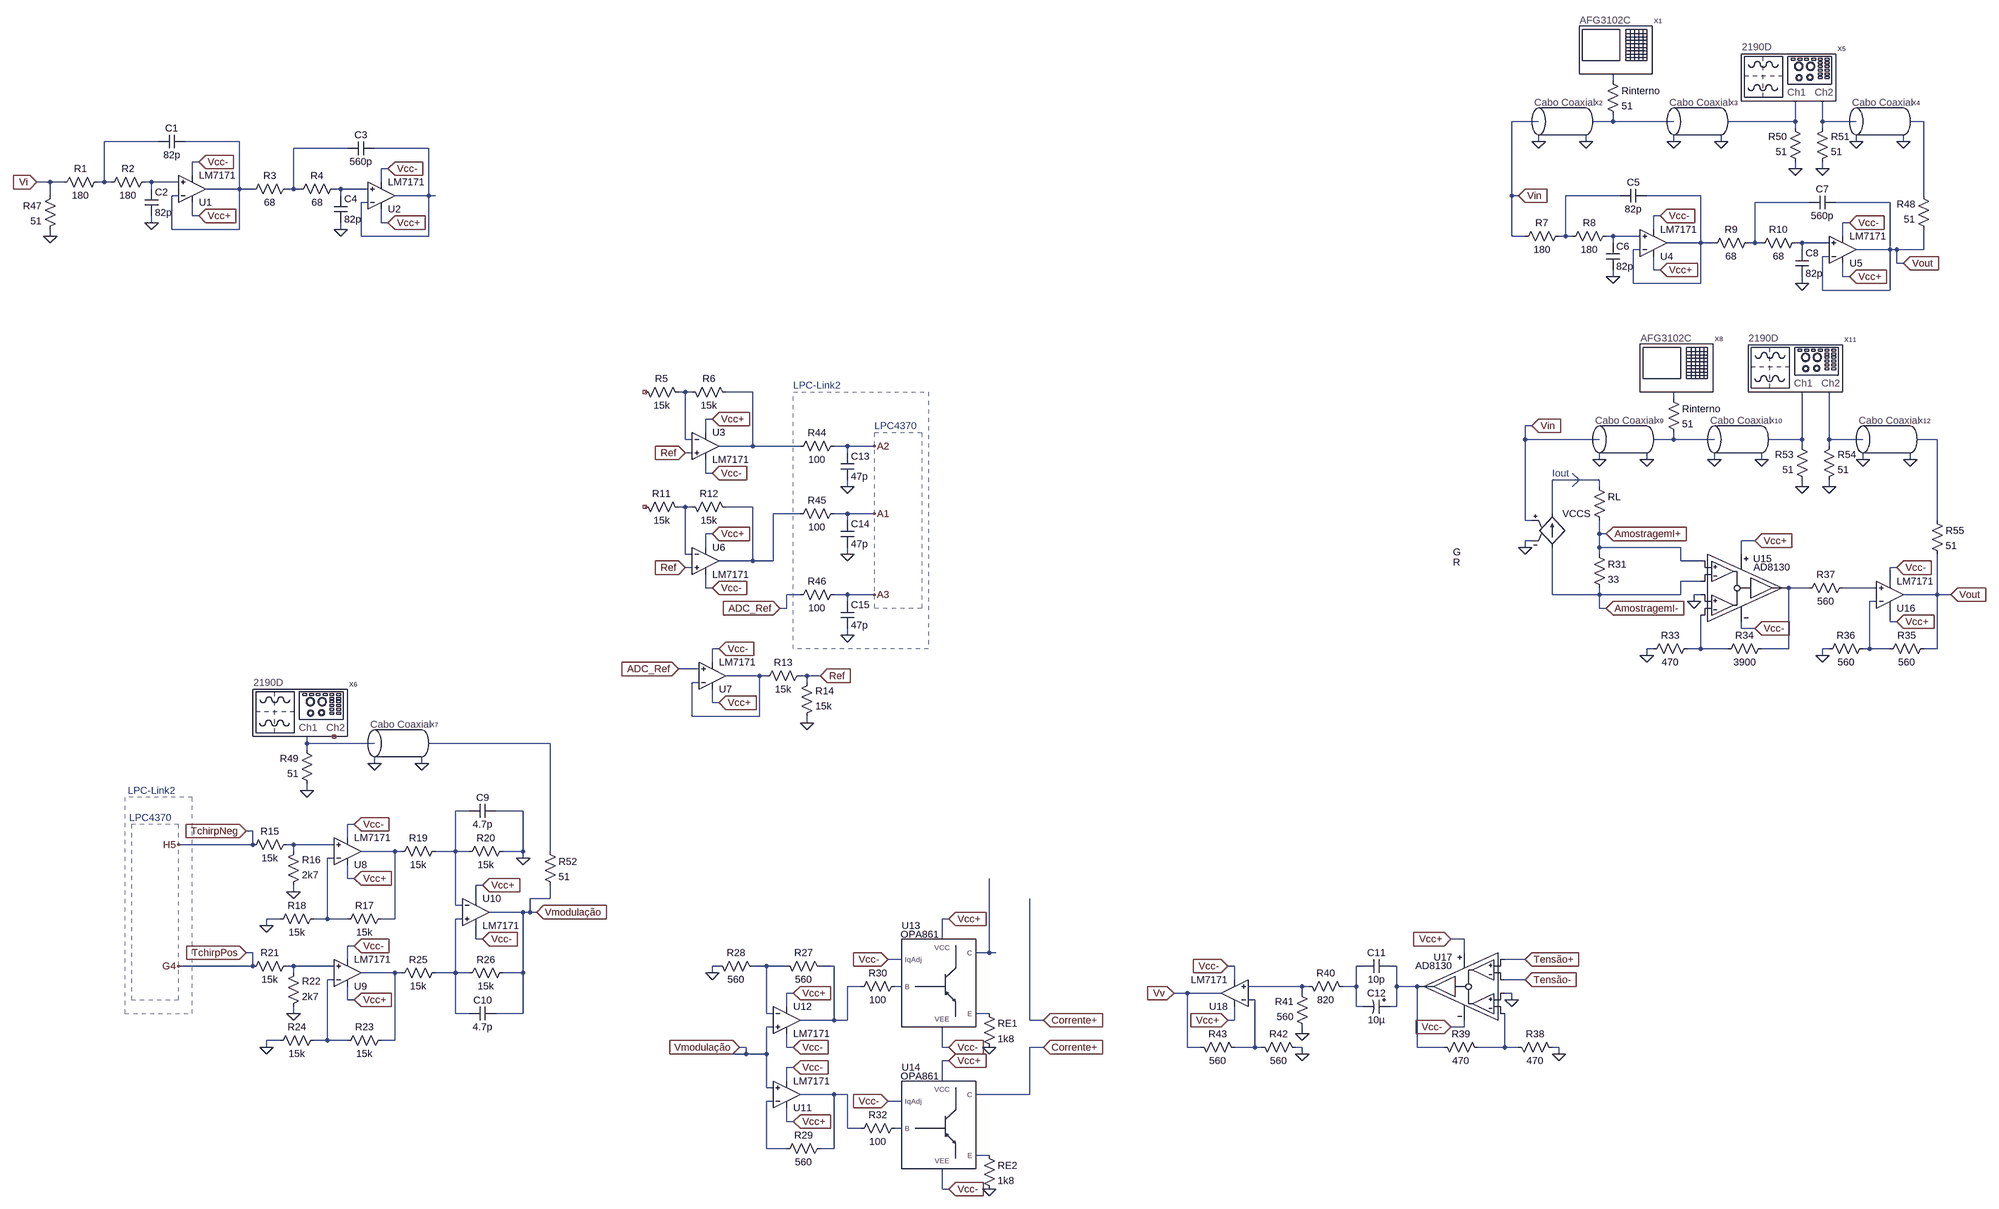
[diagram p0: schematic Circuitos de teste-Modulacao.asc]
Circuitos de teste-Modulacao.asc, the LTspice schematic file:
Version 4
SHEET 1 960 1080
WIRE -1024 -1664 -1024 -1680
WIRE -1200 -1568 -1264 -1568
WIRE -1024 -1568 -1024 -1584
WIRE -1024 -1568 -1072 -1568
WIRE -880 -1568 -1024 -1568
WIRE -592 -1568 -592 -1616
WIRE -592 -1568 -752 -1568
WIRE -528 -1568 -528 -1616
WIRE -448 -1568 -528 -1568
WIRE -288 -1568 -320 -1568
WIRE -592 -1552 -592 -1568
WIRE -528 -1552 -528 -1568
WIRE -4784 -1520 -4912 -1520
WIRE -4592 -1520 -4720 -1520
WIRE -1200 -1520 -1200 -1536
WIRE -1088 -1520 -1088 -1536
WIRE -880 -1520 -880 -1536
WIRE -768 -1520 -768 -1536
WIRE -448 -1520 -448 -1536
WIRE -336 -1520 -336 -1536
WIRE -4336 -1504 -4464 -1504
WIRE -4144 -1504 -4272 -1504
WIRE -4688 -1472 -4704 -1472
WIRE -4240 -1456 -4256 -1456
WIRE -592 -1456 -592 -1472
WIRE -528 -1456 -528 -1472
WIRE -4704 -1440 -4704 -1472
WIRE -5040 -1424 -5072 -1424
WIRE -5008 -1424 -5040 -1424
WIRE -4912 -1424 -4912 -1520
WIRE -4912 -1424 -4928 -1424
WIRE -4896 -1424 -4912 -1424
WIRE -4800 -1424 -4816 -1424
WIRE -4736 -1424 -4800 -1424
WIRE -4256 -1424 -4256 -1456
WIRE -4800 -1408 -4800 -1424
WIRE -4592 -1408 -4592 -1520
WIRE -4592 -1408 -4672 -1408
WIRE -4560 -1408 -4592 -1408
WIRE -4464 -1408 -4464 -1504
WIRE -4464 -1408 -4480 -1408
WIRE -4448 -1408 -4464 -1408
WIRE -4352 -1408 -4368 -1408
WIRE -4288 -1408 -4352 -1408
WIRE -5040 -1392 -5040 -1424
WIRE -4736 -1392 -4752 -1392
WIRE -4352 -1392 -4352 -1408
WIRE -4144 -1392 -4144 -1504
WIRE -4144 -1392 -4224 -1392
WIRE -4128 -1392 -4144 -1392
WIRE -1264 -1392 -1264 -1568
WIRE -1248 -1392 -1264 -1392
WIRE -1008 -1392 -1136 -1392
WIRE -816 -1392 -944 -1392
WIRE -288 -1392 -288 -1568
WIRE -4288 -1376 -4304 -1376
WIRE -560 -1376 -688 -1376
WIRE -368 -1376 -496 -1376
WIRE -4704 -1344 -4704 -1376
WIRE -4688 -1344 -4704 -1344
WIRE -912 -1344 -928 -1344
WIRE -4800 -1328 -4800 -1344
WIRE -4256 -1328 -4256 -1360
WIRE -4240 -1328 -4256 -1328
WIRE -464 -1328 -480 -1328
WIRE -4752 -1312 -4752 -1392
WIRE -4592 -1312 -4592 -1408
WIRE -4592 -1312 -4752 -1312
WIRE -4352 -1312 -4352 -1328
WIRE -928 -1312 -928 -1344
WIRE -5040 -1296 -5040 -1312
WIRE -4304 -1296 -4304 -1376
WIRE -4144 -1296 -4144 -1392
WIRE -4144 -1296 -4304 -1296
WIRE -1264 -1296 -1264 -1392
WIRE -1232 -1296 -1264 -1296
WIRE -1136 -1296 -1136 -1392
WIRE -1136 -1296 -1152 -1296
WIRE -1120 -1296 -1136 -1296
WIRE -1024 -1296 -1040 -1296
WIRE -960 -1296 -1024 -1296
WIRE -480 -1296 -480 -1328
WIRE -1024 -1280 -1024 -1296
WIRE -816 -1280 -816 -1392
WIRE -816 -1280 -896 -1280
WIRE -784 -1280 -816 -1280
WIRE -688 -1280 -688 -1376
WIRE -688 -1280 -704 -1280
WIRE -672 -1280 -688 -1280
WIRE -576 -1280 -592 -1280
WIRE -512 -1280 -576 -1280
WIRE -960 -1264 -976 -1264
WIRE -576 -1264 -576 -1280
WIRE -368 -1264 -368 -1376
WIRE -368 -1264 -448 -1264
WIRE -352 -1264 -368 -1264
WIRE -288 -1264 -288 -1312
WIRE -288 -1264 -352 -1264
WIRE -512 -1248 -528 -1248
WIRE -352 -1232 -352 -1264
WIRE -336 -1232 -352 -1232
WIRE -928 -1216 -928 -1248
WIRE -912 -1216 -928 -1216
WIRE -1024 -1200 -1024 -1216
WIRE -480 -1200 -480 -1232
WIRE -464 -1200 -480 -1200
WIRE -976 -1184 -976 -1264
WIRE -816 -1184 -816 -1280
WIRE -816 -1184 -976 -1184
WIRE -576 -1184 -576 -1200
WIRE -528 -1168 -528 -1248
WIRE -368 -1168 -368 -1264
WIRE -368 -1168 -528 -1168
WIRE -3536 -880 -3552 -880
WIRE -3520 -880 -3536 -880
WIRE -3376 -880 -3440 -880
WIRE -880 -864 -880 -880
WIRE -3472 -816 -3488 -816
WIRE -1216 -800 -1232 -800
WIRE -3488 -784 -3488 -816
WIRE -3536 -768 -3536 -880
WIRE -3520 -768 -3536 -768
WIRE -1232 -768 -1232 -800
WIRE -1056 -768 -1232 -768
WIRE -880 -768 -880 -784
WIRE -880 -768 -928 -768
WIRE -784 -768 -880 -768
WIRE -576 -768 -576 -880
WIRE -576 -768 -656 -768
WIRE -512 -768 -512 -880
WIRE -432 -768 -512 -768
WIRE -256 -768 -304 -768
WIRE -3376 -752 -3376 -880
WIRE -3376 -752 -3456 -752
WIRE -3264 -752 -3376 -752
WIRE -3152 -752 -3184 -752
WIRE -3088 -752 -3152 -752
WIRE -576 -752 -576 -768
WIRE -512 -752 -512 -768
WIRE -3520 -736 -3536 -736
WIRE -3152 -736 -3152 -752
WIRE -1056 -720 -1056 -736
WIRE -944 -720 -944 -736
WIRE -784 -720 -784 -736
WIRE -672 -720 -672 -736
WIRE -432 -720 -432 -736
WIRE -320 -720 -320 -736
WIRE -3488 -688 -3488 -720
WIRE -3472 -688 -3488 -688
WIRE -1056 -672 -1168 -672
WIRE -3152 -656 -3152 -672
WIRE -1056 -656 -1056 -672
WIRE -576 -656 -576 -672
WIRE -512 -656 -512 -672
WIRE -3536 -608 -3552 -608
WIRE -3520 -608 -3536 -608
WIRE -3376 -608 -3440 -608
WIRE -3264 -592 -3328 -592
WIRE -3152 -592 -3184 -592
WIRE -3088 -592 -3152 -592
WIRE -1168 -592 -1168 -672
WIRE -3152 -576 -3152 -592
WIRE -1232 -576 -1232 -768
WIRE -1216 -576 -1232 -576
WIRE -256 -576 -256 -768
WIRE -3472 -544 -3488 -544
WIRE -1056 -544 -1056 -576
WIRE -1040 -544 -1056 -544
WIRE -1216 -528 -1232 -528
WIRE -688 -528 -720 -528
WIRE -3488 -512 -3488 -544
WIRE -1232 -512 -1232 -528
WIRE -1056 -512 -1056 -544
WIRE -864 -512 -1056 -512
WIRE -3536 -496 -3536 -608
WIRE -3520 -496 -3536 -496
WIRE -3152 -496 -3152 -512
WIRE -1056 -496 -1056 -512
WIRE -720 -496 -720 -528
WIRE -3376 -480 -3376 -608
WIRE -3376 -480 -3456 -480
WIRE -3328 -480 -3328 -592
WIRE -3328 -480 -3376 -480
WIRE -864 -480 -864 -512
WIRE -816 -480 -864 -480
WIRE -3520 -464 -3536 -464
WIRE -352 -464 -368 -464
WIRE -816 -432 -864 -432
WIRE -368 -432 -368 -464
WIRE -3488 -416 -3488 -448
WIRE -3472 -416 -3488 -416
WIRE -560 -416 -608 -416
WIRE -400 -416 -480 -416
WIRE -3264 -400 -3296 -400
WIRE -3152 -400 -3184 -400
WIRE -3088 -400 -3152 -400
WIRE -1168 -400 -1168 -512
WIRE -1056 -400 -1056 -416
WIRE -1056 -400 -1168 -400
WIRE -864 -400 -864 -432
WIRE -864 -400 -1056 -400
WIRE -816 -400 -832 -400
WIRE -256 -400 -256 -496
WIRE -256 -400 -336 -400
WIRE -224 -400 -256 -400
WIRE -3152 -384 -3152 -400
WIRE -832 -384 -832 -400
WIRE -400 -384 -416 -384
WIRE -3296 -368 -3296 -400
WIRE -3296 -368 -3312 -368
WIRE -1056 -368 -1056 -400
WIRE -1040 -368 -1056 -368
WIRE -368 -336 -368 -368
WIRE -352 -336 -368 -336
WIRE -720 -320 -720 -336
WIRE -688 -320 -720 -320
WIRE -3152 -304 -3152 -320
WIRE -3456 -272 -3472 -272
WIRE -928 -272 -944 -272
WIRE -816 -272 -816 -352
WIRE -816 -272 -848 -272
WIRE -752 -272 -816 -272
WIRE -608 -272 -608 -416
WIRE -608 -272 -672 -272
WIRE -512 -272 -528 -272
WIRE -416 -272 -416 -384
WIRE -416 -272 -432 -272
WIRE -368 -272 -416 -272
WIRE -256 -272 -256 -400
WIRE -256 -272 -288 -272
WIRE -944 -256 -944 -272
WIRE -528 -256 -528 -272
WIRE -3472 -240 -3472 -272
WIRE -3504 -224 -3552 -224
WIRE -3360 -208 -3440 -208
WIRE -3344 -208 -3360 -208
WIRE -3248 -208 -3264 -208
WIRE -3216 -208 -3248 -208
WIRE -3504 -192 -3520 -192
WIRE -3248 -192 -3248 -208
WIRE -3472 -144 -3472 -176
WIRE -3456 -144 -3472 -144
WIRE -3520 -112 -3520 -192
WIRE -3360 -112 -3360 -208
WIRE -3360 -112 -3520 -112
WIRE -3248 -96 -3248 -112
WIRE -4432 -48 -4432 -64
WIRE -4272 -48 -4432 -48
WIRE -3856 -48 -4144 -48
WIRE -4432 -32 -4432 -48
WIRE -4272 0 -4272 -16
WIRE -4160 0 -4160 -16
WIRE -4432 64 -4432 48
WIRE -4048 112 -4080 112
WIRE -3920 112 -3984 112
WIRE -4320 144 -4336 144
WIRE -4560 160 -4576 160
WIRE -4336 176 -4336 144
WIRE -4560 192 -4560 160
WIRE -4560 192 -4736 192
WIRE -4464 192 -4480 192
WIRE -4368 192 -4464 192
WIRE -4464 208 -4464 192
WIRE -4224 208 -4304 208
WIRE -4208 208 -4224 208
WIRE -4080 208 -4080 112
WIRE -4080 208 -4128 208
WIRE -4048 208 -4080 208
WIRE -3920 208 -3920 112
WIRE -3920 208 -3968 208
WIRE -3856 208 -3856 -48
WIRE -4368 224 -4384 224
WIRE -3920 224 -3920 208
WIRE -4336 272 -4336 240
WIRE -4320 272 -4336 272
WIRE -4016 288 -4032 288
WIRE -4464 304 -4464 288
WIRE -4032 320 -4032 288
WIRE -3856 320 -3856 288
WIRE -3856 320 -3904 320
WIRE -4080 336 -4080 208
WIRE -4064 336 -4080 336
WIRE -3920 352 -4000 352
WIRE -3904 352 -3904 320
WIRE -3904 352 -3920 352
WIRE -3888 352 -3904 352
WIRE -4496 368 -4528 368
WIRE -4384 368 -4384 224
WIRE -4384 368 -4416 368
WIRE -4336 368 -4384 368
WIRE -4224 368 -4224 208
WIRE -4224 368 -4256 368
WIRE -4064 368 -4080 368
WIRE -2912 368 -2928 368
WIRE -4528 384 -4528 368
WIRE -4032 416 -4032 384
WIRE -4016 416 -4032 416
WIRE -2928 416 -2928 368
WIRE -1376 416 -1408 416
WIRE -4320 432 -4336 432
WIRE -4560 448 -4576 448
WIRE -2816 448 -2816 272
WIRE -2816 448 -2848 448
WIRE -2800 448 -2816 448
WIRE -1376 448 -1376 416
WIRE -4336 464 -4336 432
WIRE -3024 464 -3056 464
WIRE -1232 464 -1280 464
WIRE -4560 480 -4560 448
WIRE -4560 480 -4736 480
WIRE -4464 480 -4480 480
WIRE -4368 480 -4464 480
WIRE -3456 480 -3472 480
WIRE -3344 480 -3376 480
WIRE -3296 480 -3344 480
WIRE -3184 480 -3216 480
WIRE -1920 480 -1936 480
WIRE -1616 480 -1632 480
WIRE -1536 480 -1552 480
WIRE -4464 496 -4464 480
WIRE -4224 496 -4304 496
WIRE -4208 496 -4224 496
WIRE -4080 496 -4080 368
WIRE -4080 496 -4128 496
WIRE -4048 496 -4080 496
WIRE -3920 496 -3920 352
WIRE -3920 496 -3968 496
WIRE -3472 496 -3472 480
WIRE -4368 512 -4384 512
WIRE -1920 512 -1920 480
WIRE -1232 512 -1280 512
WIRE -3120 528 -3152 528
WIRE -3024 528 -3040 528
WIRE -1760 528 -1888 528
WIRE -1744 528 -1760 528
WIRE -1632 528 -1632 480
WIRE -1632 528 -1664 528
WIRE -1536 528 -1536 480
WIRE -1488 528 -1536 528
WIRE -3280 544 -3296 544
WIRE -2032 544 -2064 544
WIRE -1952 544 -2032 544
WIRE -1760 544 -1760 528
WIRE -1264 544 -1280 544
WIRE -4336 560 -4336 528
WIRE -4320 560 -4336 560
WIRE -1872 560 -1888 560
WIRE -1264 560 -1264 544
WIRE -3296 576 -3296 544
WIRE -1632 576 -1632 528
WIRE -1616 576 -1632 576
WIRE -1536 576 -1536 528
WIRE -1536 576 -1552 576
WIRE -4464 592 -4464 576
WIRE -4080 592 -4080 496
WIRE -4048 592 -4080 592
WIRE -3920 592 -3920 496
WIRE -3920 592 -3984 592
WIRE -3344 592 -3344 480
WIRE -3328 592 -3344 592
WIRE -2816 592 -2848 592
WIRE -3184 608 -3184 480
WIRE -3184 608 -3264 608
WIRE -3152 608 -3152 528
WIRE -3152 608 -3184 608
WIRE -2720 608 -2720 320
WIRE -2688 608 -2720 608
WIRE -1920 608 -1920 576
WIRE -1920 608 -1936 608
WIRE -3328 624 -3344 624
WIRE -1376 624 -1376 608
WIRE -1376 624 -1408 624
WIRE -1760 640 -1760 624
WIRE -4496 656 -4528 656
WIRE -4384 656 -4384 512
WIRE -4384 656 -4416 656
WIRE -4336 656 -4384 656
WIRE -4224 656 -4224 496
WIRE -4224 656 -4256 656
WIRE -4528 672 -4528 656
WIRE -3392 672 -3408 672
WIRE -3296 672 -3296 640
WIRE -3280 672 -3296 672
WIRE -2928 672 -2928 624
WIRE -2912 672 -2928 672
WIRE -2688 672 -2720 672
WIRE -2032 672 -2032 544
WIRE -2000 672 -2032 672
WIRE -1872 672 -1872 560
WIRE -1872 672 -1920 672
WIRE -1856 672 -1872 672
WIRE -1760 672 -1776 672
WIRE -1488 672 -1488 528
WIRE -1424 672 -1488 672
WIRE -1280 672 -1280 592
WIRE -1280 672 -1344 672
WIRE -1248 672 -1280 672
WIRE -1152 672 -1168 672
WIRE -3392 688 -3392 672
WIRE -3392 688 -3552 688
WIRE -3344 688 -3344 624
WIRE -3344 688 -3392 688
WIRE -1760 688 -1760 672
WIRE -1152 688 -1152 672
WIRE -2912 704 -2928 704
WIRE -3280 720 -3296 720
WIRE -3296 752 -3296 720
WIRE -2928 752 -2928 704
WIRE -3344 768 -3344 688
WIRE -3328 768 -3344 768
WIRE -3184 784 -3264 784
WIRE -3152 784 -3184 784
WIRE -2720 784 -2720 672
WIRE -2720 784 -2848 784
WIRE -3328 800 -3344 800
WIRE -3024 800 -3056 800
WIRE -3296 848 -3296 816
WIRE -3280 848 -3296 848
WIRE -3152 864 -3152 784
WIRE -3120 864 -3152 864
WIRE -3024 864 -3040 864
WIRE -3344 912 -3344 800
WIRE -3296 912 -3344 912
WIRE -3184 912 -3184 784
WIRE -3184 912 -3216 912
WIRE -2816 928 -2848 928
WIRE -2928 1008 -2928 960
WIRE -2912 1008 -2928 1008
FLAG -4800 -1328 0
FLAG -4688 -1344 Vcc+
IOPIN -4688 -1344 In
FLAG -4688 -1472 Vcc-
IOPIN -4688 -1472 In
FLAG -4352 -1312 0
FLAG -4240 -1328 Vcc+
IOPIN -4240 -1328 In
FLAG -4240 -1456 Vcc-
IOPIN -4240 -1456 In
FLAG -3472 -816 Vcc+
IOPIN -3472 -816 In
FLAG -3472 -688 Vcc-
IOPIN -3472 -688 In
FLAG -1024 -1200 0
FLAG -912 -1216 Vcc+
IOPIN -912 -1216 In
FLAG -912 -1344 Vcc-
IOPIN -912 -1344 In
FLAG -576 -1184 0
FLAG -464 -1200 Vcc+
IOPIN -464 -1200 In
FLAG -464 -1328 Vcc-
IOPIN -464 -1328 In
FLAG -3472 -544 Vcc+
IOPIN -3472 -544 In
FLAG -3472 -416 Vcc-
IOPIN -3472 -416 In
FLAG -3456 -144 Vcc+
IOPIN -3456 -144 In
FLAG -3456 -272 Vcc-
IOPIN -3456 -272 In
FLAG -3248 -96 0
FLAG -3552 -224 ADC_Ref
IOPIN -3552 -224 In
FLAG -3216 -208 Ref
IOPIN -3216 -208 In
FLAG -3536 -464 Ref
IOPIN -3536 -464 In
FLAG -3536 -736 Ref
IOPIN -3536 -736 In
FLAG -4320 272 Vcc+
IOPIN -4320 272 In
FLAG -4320 144 Vcc-
IOPIN -4320 144 In
FLAG -4464 304 0
FLAG -4320 560 Vcc+
IOPIN -4320 560 In
FLAG -4320 432 Vcc-
IOPIN -4320 432 In
FLAG -4464 592 0
FLAG -4016 288 Vcc+
IOPIN -4016 288 In
FLAG -4016 416 Vcc-
IOPIN -4016 416 In
FLAG -3920 224 0
FLAG -4576 160 TchirpNeg
IOPIN -4576 160 In
FLAG -4576 448 TchirpPos
IOPIN -4576 448 In
FLAG -4528 672 0
FLAG -4528 384 0
FLAG -3280 848 Vcc+
IOPIN -3280 848 In
FLAG -3280 720 Vcc-
IOPIN -3280 720 In
FLAG -3280 544 Vcc+
IOPIN -3280 544 In
FLAG -3280 672 Vcc-
IOPIN -3280 672 In
FLAG -3472 496 0
FLAG -2912 672 Vcc-
IOPIN -2912 672 In
FLAG -2912 368 Vcc+
IOPIN -2912 368 In
FLAG -2816 672 0
FLAG -2912 1008 Vcc-
IOPIN -2912 1008 In
FLAG -2912 704 Vcc+
IOPIN -2912 704 In
FLAG -2816 1008 0
FLAG -3056 464 Vcc-
IOPIN -3056 464 In
FLAG -3056 800 Vcc-
IOPIN -3056 800 In
FLAG -832 -384 0
FLAG -944 -256 0
FLAG -352 -336 Vcc+
IOPIN -352 -336 In
FLAG -352 -464 Vcc-
IOPIN -352 -464 In
FLAG -528 -256 0
FLAG -688 -320 Vcc-
IOPIN -688 -320 In
FLAG -688 -528 Vcc+
IOPIN -688 -528 In
FLAG -1040 -368 AmostragemI-
IOPIN -1040 -368 In
FLAG -1040 -544 AmostragemI+
IOPIN -1040 -544 In
FLAG -1264 560 0
FLAG -1152 688 0
FLAG -1936 608 Vcc+
IOPIN -1936 608 In
FLAG -1936 480 Vcc-
IOPIN -1936 480 In
FLAG -1760 688 0
FLAG -1408 624 Vcc-
IOPIN -1408 624 In
FLAG -1408 416 Vcc+
IOPIN -1408 416 In
FLAG -1232 512 Tensão-
IOPIN -1232 512 In
FLAG -1232 464 Tensão+
IOPIN -1232 464 In
FLAG -1760 640 0
FLAG -224 -400 Vout
IOPIN -224 -400 In
FLAG -2064 544 Vv
IOPIN -2064 544 In
FLAG -2688 672 Corrente+
IOPIN -2688 672 In
FLAG -2688 608 Corrente+
IOPIN -2688 608 In
FLAG -3152 -656 0
FLAG -3152 -496 0
FLAG -5072 -1424 Vi
IOPIN -5072 -1424 In
FLAG -1248 -1392 Vin
IOPIN -1248 -1392 In
FLAG -3152 -304 0
FLAG -3312 -368 ADC_Ref
IOPIN -3312 -368 In
FLAG -3088 -752 A2
FLAG -3088 -592 A1
FLAG -3088 -400 A3
FLAG -3408 672 Vmodulação
IOPIN -3408 672 In
FLAG -3888 352 Vmodulação
IOPIN -3888 352 In
FLAG -4736 192 H5
FLAG -4736 480 G4
FLAG -5040 -1296 0
FLAG -1200 -1520 0
FLAG -1088 -1520 0
FLAG -880 -1520 0
FLAG -768 -1520 0
FLAG -592 -1456 0
FLAG -528 -1456 0
FLAG -448 -1520 0
FLAG -336 -1520 0
FLAG -336 -1232 Vout
IOPIN -336 -1232 In
FLAG -4432 64 0
FLAG -4272 0 0
FLAG -4160 0 0
FLAG -1056 -720 0
FLAG -944 -720 0
FLAG -784 -720 0
FLAG -672 -720 0
FLAG -576 -656 0
FLAG -512 -656 0
FLAG -432 -720 0
FLAG -320 -720 0
FLAG -1232 -512 0
FLAG -1216 -800 Vin
IOPIN -1216 -800 In
SYMBOL Opamps\\opamp2 -4704 -1344 M180
SYMATTR InstName U1
SYMATTR Value LM7171
SYMBOL res -4912 -1440 R90
WINDOW 0 0 56 VBottom 2
WINDOW 3 32 56 VTop 2
SYMATTR InstName R1
SYMATTR Value 180
SYMBOL res -4800 -1440 R90
WINDOW 0 0 56 VBottom 2
WINDOW 3 32 56 VTop 2
SYMATTR InstName R2
SYMATTR Value 180
SYMBOL cap -4720 -1536 R90
WINDOW 0 0 32 VBottom 2
WINDOW 3 32 32 VTop 2
SYMATTR InstName C1
SYMATTR Value 82p
SYMBOL cap -4816 -1408 R0
SYMATTR InstName C2
SYMATTR Value 82p
SYMBOL Opamps\\opamp2 -4256 -1328 M180
SYMATTR InstName U2
SYMATTR Value LM7171
SYMBOL res -4464 -1424 R90
WINDOW 0 0 56 VBottom 2
WINDOW 3 32 56 VTop 2
SYMATTR InstName R3
SYMATTR Value 68
SYMBOL res -4352 -1424 R90
WINDOW 0 0 56 VBottom 2
WINDOW 3 32 56 VTop 2
SYMATTR InstName R4
SYMATTR Value 68
SYMBOL cap -4272 -1520 R90
WINDOW 0 0 32 VBottom 2
WINDOW 3 32 32 VTop 2
SYMATTR InstName C3
SYMATTR Value 560p
SYMBOL cap -4368 -1392 R0
SYMATTR InstName C4
SYMATTR Value 82p
SYMBOL Opamps\\opamp2 -3488 -816 R0
SYMATTR InstName U3
SYMATTR Value LM7171
SYMBOL res -3536 -864 M270
WINDOW 0 32 56 VTop 2
WINDOW 3 0 56 VBottom 2
SYMATTR InstName R5
SYMATTR Value 15k
SYMBOL res -3424 -864 M270
WINDOW 0 32 56 VTop 2
WINDOW 3 0 56 VBottom 2
SYMATTR InstName R6
SYMATTR Value 15k
SYMBOL Opamps\\opamp2 -928 -1216 M180
SYMATTR InstName U4
SYMATTR Value LM7171
SYMBOL res -1136 -1312 R90
WINDOW 0 0 56 VBottom 2
WINDOW 3 32 56 VTop 2
SYMATTR InstName R7
SYMATTR Value 180
SYMBOL res -1024 -1312 R90
WINDOW 0 0 56 VBottom 2
WINDOW 3 32 56 VTop 2
SYMATTR InstName R8
SYMATTR Value 180
SYMBOL cap -944 -1408 R90
WINDOW 0 0 32 VBottom 2
WINDOW 3 32 32 VTop 2
SYMATTR InstName C5
SYMATTR Value 82p
SYMBOL cap -1040 -1280 R0
SYMATTR InstName C6
SYMATTR Value 82p
SYMBOL Opamps\\opamp2 -480 -1200 M180
SYMATTR InstName U5
SYMATTR Value LM7171
SYMBOL res -688 -1296 R90
WINDOW 0 0 56 VBottom 2
WINDOW 3 32 56 VTop 2
SYMATTR InstName R9
SYMATTR Value 68
SYMBOL res -576 -1296 R90
WINDOW 0 0 56 VBottom 2
WINDOW 3 32 56 VTop 2
SYMATTR InstName R10
SYMATTR Value 68
SYMBOL cap -496 -1392 R90
WINDOW 0 0 32 VBottom 2
WINDOW 3 32 32 VTop 2
SYMATTR InstName C7
SYMATTR Value 560p
SYMBOL cap -592 -1264 R0
SYMATTR InstName C8
SYMATTR Value 82p
SYMBOL Opamps\\opamp2 -3488 -544 R0
SYMATTR InstName U6
SYMATTR Value LM7171
SYMBOL res -3536 -592 M270
WINDOW 0 32 56 VTop 2
WINDOW 3 0 56 VBottom 2
SYMATTR InstName R11
SYMATTR Value 15k
SYMBOL res -3424 -592 M270
WINDOW 0 32 56 VTop 2
WINDOW 3 0 56 VBottom 2
SYMATTR InstName R12
SYMATTR Value 15k
SYMBOL Opamps\\opamp2 -3472 -144 M180
SYMATTR InstName U7
SYMATTR Value LM7171
SYMBOL res -3248 -224 R90
WINDOW 0 0 56 VBottom 2
WINDOW 3 32 56 VTop 2
SYMATTR InstName R13
SYMATTR Value 15k
SYMBOL res -3264 -96 M180
WINDOW 0 36 76 Left 2
WINDOW 3 36 40 Left 2
SYMATTR InstName R14
SYMATTR Value 15k
SYMBOL Opamps\\opamp2 -4336 272 M180
SYMATTR InstName U8
SYMATTR Value LM7171
SYMBOL res -4464 176 R90
WINDOW 0 0 56 VBottom 2
WINDOW 3 32 56 VTop 2
SYMATTR InstName R15
SYMATTR Value 15k
SYMBOL res -4480 304 M180
WINDOW 0 36 76 Left 2
WINDOW 3 36 40 Left 2
SYMATTR InstName R16
SYMATTR Value 2k7
SYMBOL res -4240 352 R90
WINDOW 0 0 56 VBottom 2
WINDOW 3 32 56 VTop 2
SYMATTR InstName R17
SYMATTR Value 15k
SYMBOL res -4512 384 R270
WINDOW 0 32 56 VTop 2
WINDOW 3 0 56 VBottom 2
SYMATTR InstName R18
SYMATTR Value 15k
SYMBOL res -4112 192 R90
WINDOW 0 0 56 VBottom 2
WINDOW 3 32 56 VTop 2
SYMATTR InstName R19
SYMATTR Value 15k
SYMBOL res -3952 192 R90
WINDOW 0 0 56 VBottom 2
WINDOW 3 32 56 VTop 2
SYMATTR InstName R20
SYMATTR Value 15k
SYMBOL cap -3984 96 R90
WINDOW 0 0 32 VBottom 2
WINDOW 3 32 32 VTop 2
SYMATTR InstName C9
SYMATTR Value 4.7p
SYMBOL Opamps\\opamp2 -4336 560 M180
SYMATTR InstName U9
SYMATTR Value LM7171
SYMBOL res -4464 464 R90
WINDOW 0 0 56 VBottom 2
WINDOW 3 32 56 VTop 2
SYMATTR InstName R21
SYMATTR Value 15k
SYMBOL res -4480 592 M180
WINDOW 0 36 76 Left 2
WINDOW 3 36 40 Left 2
SYMATTR InstName R22
SYMATTR Value 2k7
SYMBOL res -4240 640 R90
WINDOW 0 0 56 VBottom 2
WINDOW 3 32 56 VTop 2
SYMATTR InstName R23
SYMATTR Value 15k
SYMBOL res -4512 672 R270
WINDOW 0 32 56 VTop 2
WINDOW 3 0 56 VBottom 2
SYMATTR InstName R24
SYMATTR Value 15k
SYMBOL Opamps\\opamp2 -4032 288 R0
SYMATTR InstName U10
SYMATTR Value LM7171
SYMBOL res -4112 480 R90
WINDOW 0 0 56 VBottom 2
WINDOW 3 32 56 VTop 2
SYMATTR InstName R25
SYMATTR Value 15k
SYMBOL res -3952 480 R90
WINDOW 0 0 56 VBottom 2
WINDOW 3 32 56 VTop 2
SYMATTR InstName R26
SYMATTR Value 15k
SYMBOL cap -3984 576 R90
WINDOW 0 0 32 VBottom 2
WINDOW 3 32 32 VTop 2
SYMATTR InstName C10
SYMATTR Value 4.7p
SYMBOL Opamps\\opamp2 -3296 848 M180
SYMATTR InstName U11
SYMATTR Value LM7171
SYMBOL res -3200 896 R90
WINDOW 0 0 56 VBottom 2
WINDOW 3 32 56 VTop 2
SYMATTR InstName R29
SYMATTR Value 560
SYMBOL Opamps\\opamp2 -3296 544 R0
SYMATTR InstName U12
SYMATTR Value LM7171
SYMBOL res -3200 496 M270
WINDOW 0 32 56 VTop 2
WINDOW 3 0 56 VBottom 2
SYMATTR InstName R27
SYMATTR Value 560
SYMBOL res -3360 496 M270
WINDOW 0 32 56 VTop 2
WINDOW 3 0 56 VBottom 2
SYMATTR InstName R28
SYMATTR Value 560
SYMBOL opa681 -2960 560 R0
SYMATTR InstName U13
SYMBOL res -2832 576 R0
SYMATTR InstName RE1
SYMATTR Value 1k8
SYMBOL res -3024 512 R90
WINDOW 0 0 56 VBottom 2
WINDOW 3 32 56 VTop 2
SYMATTR InstName R30
SYMATTR Value 100
SYMBOL opa681 -2960 896 R0
SYMATTR InstName U14
SYMBOL res -2832 912 R0
SYMATTR InstName RE2
SYMATTR Value 1k8
SYMBOL res -3024 848 R90
WINDOW 0 0 56 VBottom 2
WINDOW 3 32 56 VTop 2
SYMATTR InstName R32
SYMATTR Value 100
SYMBOL res -1072 -512 R0
SYMATTR InstName R31
SYMATTR Value 33
SYMBOL ad8130 -736 -416 R0
SYMATTR InstName U15
SYMBOL res -832 -288 R90
WINDOW 0 0 56 VBottom 2
WINDOW 3 32 56 VTop 2
SYMATTR InstName R33
SYMATTR Value 470
SYMBOL res -656 -288 R90
WINDOW 0 0 56 VBottom 2
WINDOW 3 32 56 VTop 2
SYMATTR InstName R34
SYMATTR Value 3900
SYMBOL res -464 -432 R90
WINDOW 0 0 56 VBottom 2
WINDOW 3 32 56 VTop 2
SYMATTR InstName R37
SYMATTR Value 560
SYMBOL Opamps\\opamp2 -368 -336 M180
SYMATTR InstName U16
SYMATTR Value LM7171
SYMBOL res -272 -288 R90
WINDOW 0 0 56 VBottom 2
WINDOW 3 32 56 VTop 2
SYMATTR InstName R35
SYMATTR Value 560
SYMBOL res -416 -288 R90
WINDOW 0 0 56 VBottom 2
WINDOW 3 32 56 VTop 2
SYMATTR InstName R36
SYMATTR Value 560
SYMBOL ad8130 -1360 528 M0
SYMATTR InstName U17
SYMBOL res -1264 656 M90
WINDOW 0 0 56 VBottom 2
WINDOW 3 32 56 VTop 2
SYMATTR InstName R38
SYMATTR Value 470
SYMBOL res -1440 656 M90
WINDOW 0 0 56 VBottom 2
WINDOW 3 32 56 VTop 2
SYMATTR InstName R39
SYMATTR Value 470
SYMBOL res -1760 512 M90
WINDOW 0 0 56 VBottom 2
WINDOW 3 32 56 VTop 2
SYMATTR InstName R40
SYMATTR Value 820
SYMBOL Opamps\\opamp2 -1920 608 R180
SYMATTR InstName U18
SYMATTR Value LM7171
SYMBOL res -2016 656 M90
WINDOW 0 0 56 VBottom 2
WINDOW 3 32 56 VTop 2
SYMATTR InstName R43
SYMATTR Value 560
SYMBOL res -1872 656 M90
WINDOW 0 0 56 VBottom 2
WINDOW 3 32 56 VTop 2
SYMATTR InstName R42
SYMATTR Value 560
SYMBOL cap -1616 464 M90
WINDOW 0 0 32 VBottom 2
WINDOW 3 32 32 VTop 2
SYMATTR InstName C11
SYMATTR Value 10p
SYMBOL polcap -1552 560 R90
WINDOW 0 0 32 VBottom 2
WINDOW 3 32 32 VTop 2
SYMATTR InstName C12
SYMATTR Value 10µ
SYMATTR Description Capacitor
SYMATTR Type cap
SYMATTR SpiceLine V=4 Irms=3.72678 Rser=0.018 Lser=0 mfg="KEMET" pn="A700D107M004ATE018" type="Al electrolytic"
SYMBOL res -1744 640 R180
WINDOW 0 36 76 Left 2
WINDOW 3 36 40 Left 2
SYMATTR InstName R41
SYMATTR Value 560
SYMBOL res -3168 -768 R90
WINDOW 0 0 56 VBottom 2
WINDOW 3 32 56 VTop 2
SYMATTR InstName R44
SYMATTR Value 100
SYMBOL cap -3168 -736 R0
SYMATTR InstName C13
SYMATTR Value 47p
SYMBOL res -3168 -608 R90
WINDOW 0 0 56 VBottom 2
WINDOW 3 32 56 VTop 2
SYMATTR InstName R45
SYMATTR Value 100
SYMBOL cap -3168 -576 R0
SYMATTR InstName C14
SYMATTR Value 47p
SYMBOL res -3168 -416 R90
WINDOW 0 0 56 VBottom 2
WINDOW 3 32 56 VTop 2
SYMATTR InstName R46
SYMATTR Value 100
SYMBOL cap -3168 -384 R0
SYMATTR InstName C15
SYMATTR Value 47p
SYMBOL res -5024 -1408 M0
SYMATTR InstName R47
SYMATTR Value 51
SYMBOL afg3102c -1104 -1680 R0
SYMATTR InstName X1
SYMBOL coaxialCable -1216 -1536 R0
SYMATTR InstName X2
SYMBOL res -272 -1296 R180
WINDOW 0 36 76 Left 2
WINDOW 3 36 40 Left 2
SYMATTR InstName R48
SYMATTR Value 51
SYMBOL res -1040 -1680 R0
SYMATTR InstName Rinterno
SYMATTR Value 51
SYMBOL coaxialCable -896 -1536 R0
SYMATTR InstName X3
SYMBOL osc -720 -1616 R0
SYMATTR InstName X5
SYMBOL res -576 -1456 R180
WINDOW 0 36 76 Left 2
WINDOW 3 36 40 Left 2
SYMATTR InstName R50
SYMATTR Value 51
SYMBOL res -544 -1456 M180
WINDOW 0 36 76 Left 2
WINDOW 3 36 40 Left 2
SYMATTR InstName R51
SYMATTR Value 51
SYMBOL coaxialCable -464 -1536 R0
SYMATTR InstName X4
SYMBOL osc -4560 -64 R0
SYMATTR InstName X6
SYMBOL res -4416 64 R180
WINDOW 0 36 76 Left 2
WINDOW 3 36 40 Left 2
SYMATTR InstName R49
SYMATTR Value 51
SYMBOL coaxialCable -4288 -16 R0
SYMATTR InstName X7
SYMBOL res -3872 192 R0
SYMATTR InstName R52
SYMATTR Value 51
SYMBOL afg3102c -960 -880 R0
SYMATTR InstName X8
SYMBOL coaxialCable -1072 -736 R0
SYMATTR InstName X9
SYMBOL res -896 -880 R0
SYMATTR InstName Rinterno
SYMATTR Value 51
SYMBOL coaxialCable -800 -736 R0
SYMATTR InstName X10
SYMBOL osc -704 -880 R0
SYMATTR InstName X11
SYMBOL res -560 -656 R180
WINDOW 0 36 76 Left 2
WINDOW 3 36 40 Left 2
SYMATTR InstName R53
SYMATTR Value 51
SYMBOL res -528 -656 M180
WINDOW 0 36 76 Left 2
WINDOW 3 36 40 Left 2
SYMATTR InstName R54
SYMATTR Value 51
SYMBOL coaxialCable -448 -736 R0
SYMATTR InstName X12
SYMBOL res -272 -592 R0
SYMATTR InstName R55
SYMATTR Value 51
SYMBOL g -1168 -608 R0
WINDOW 3 -235 107 Left 2
SYMATTR InstName VCCS
SYMBOL res -1072 -672 R0
WINDOW 3 -331 195 Left 2
SYMATTR InstName RL
TEXT -3280 -896 Left 2 ;LPC-Link2
TEXT -3088 -800 Left 2 ;LPC4370
TEXT -4744 64 Right 2 ;LPC-Link2
TEXT -4752 128 Right 2 ;LPC4370
TEXT -1168 -688 Left 2 ;Iout
LINE Normal -1120 -688 -1104 -672
LINE Normal -1104 -672 -1120 -688 2
LINE Normal -1104 -672 -1104 -672 2
LINE Normal -1120 -656 -1104 -672
RECTANGLE Normal -2960 -272 -3280 -880 2
RECTANGLE Normal -2976 -368 -3088 -784 2
RECTANGLE Normal -4864 592 -4704 80 2
RECTANGLE Normal -4848 560 -4736 144 2

The netlist it stands for:
* Circuitos de teste-Modulacao.asc
XU1 N010 N007 Vcc+ Vcc- N007 LM7171  ; pins In+ In- V+ V- OUT
R1 N006 Vi 180
R2 N010 N006 180
C1 N007 N006 82p
C2 N010 0 82p
XU2 N011 N009 Vcc+ Vcc- N009 LM7171  ; pins In+ In- V+ V- OUT
R3 N008 N007 68
R4 N011 N008 68
C3 N009 N008 560p
C4 N011 0 82p
XU3 Ref N017 Vcc+ Vcc- N018 LM7171  ; pins In+ In- V+ V- OUT
R5 N017 NC_01 15k
R6 N018 N017 15k
XU4 N015 N013 Vcc+ Vcc- N013 LM7171  ; pins In+ In- V+ V- OUT
R7 N012 Vin 180
R8 N015 N012 180
C5 N013 N012 82p
C6 N015 0 82p
XU5 N016 Vout Vcc+ Vcc- Vout LM7171  ; pins In+ In- V+ V- OUT
R9 N014 N013 68
R10 N016 N014 68
C7 Vout N014 560p
C8 N016 0 82p
XU6 Ref N025 Vcc+ Vcc- N026 LM7171  ; pins In+ In- V+ V- OUT
R11 N025 NC_02 15k
R12 N026 N025 15k
XU7 ADC_Ref N031 Vcc+ Vcc- N031 LM7171  ; pins In+ In- V+ V- OUT
R13 Ref N031 15k
R14 0 Ref 15k
XU8 N035 N037 Vcc+ Vcc- N036 LM7171  ; pins In+ In- V+ V- OUT
R15 N035 H5 15k
R16 0 N035 2k7
R17 N036 N037 15k
R18 0 N037 15k
R19 N034 N036 15k
R20 0 N034 15k
C9 0 N034 4.7p
XU9 N040 N046 Vcc+ Vcc- N045 LM7171  ; pins In+ In- V+ V- OUT
R21 N040 G4 15k
R22 0 N040 2k7
R23 N045 N046 15k
R24 0 N046 15k
XU10 N038 N034 Vcc+ Vcc- Vmodulação LM7171  ; pins In+ In- V+ V- OUT
R25 N038 N045 15k
R26 Vmodulação N038 15k
C10 Vmodulação N038 4.7p
XU11 Vmodulação N053 Vcc+ Vcc- N052 LM7171  ; pins In+ In- V+ V- OUT
R29 N052 N053 560
XU12 Vmodulação N041 Vcc+ Vcc- N042 LM7171  ; pins In+ In- V+ V- OUT
R27 N042 N041 560
R28 N041 0 560
XU13 N047 N039 N050 Vcc- Vcc+ Vcc- OPA861  ; pins B C E IqAdj VCC VEE
RE1 N050 0 1k8
R30 N047 N042 100
XU14 N054 Corrente+ N055 Vcc- Vcc+ Vcc- OPA861  ; pins B C E IqAdj VCC VEE
RE2 N055 0 1k8
R32 N054 N052 100
R31 AmostragemI+ AmostragemI- 33
XU15 AmostragemI+ AmostragemI- 0 N030 Vcc+ Vcc- N027 AD8130  ; pins 1 2 3 4 99 50 45
R33 N030 0 470
R34 N027 N030 3900
R37 N028 N027 560
XU16 N028 N029 Vcc+ Vcc- Vout LM7171  ; pins In+ In- V+ V- OUT
R35 Vout N029 560
R36 N029 0 560
XU17 Tensão+ Tensão- 0 N051 Vcc+ Vcc- N044 AD8130  ; pins 1 2 3 4 99 50 45
R38 N051 0 470
R39 N044 N051 470
R40 N048 N043 820
XU18 N048 N049 Vcc+ Vcc- Vv LM7171  ; pins In+ In- V+ V- OUT
R43 Vv N049 560
R42 N049 0 560
C11 N043 N044 10p
C12 N044 N043 10µ V=4 Irms=3.72678 Rser=0.018 Lser=0 mfg="KEMET" pn="A700D107M004ATE018" type="Al electrolytic"
R41 0 N048 560
R44 A2 N018 100
C13 A2 0 47p
R45 A1 N026 100
C14 A1 0 47p
R46 A3 ADC_Ref 100
C15 A3 0 47p
R47 Vi 0 51
XX1 N001 afg3102c
XX2 Vin 0 0 N002 coaxialCable
R48 Vout N005 51
Rinterno N001 N002 51
XX3 N002 0 0 N003 coaxialCable
XX5 N003 N004 osc
R50 0 N003 51
R51 0 N004 51
XX4 N004 0 0 N005 coaxialCable
XX6 N032 NC_03 osc
R49 0 N032 51
XX7 N032 0 0 N033 coaxialCable
R52 N033 Vmodulação 51
XX8 N019 afg3102c
XX9 Vin 0 0 N020 coaxialCable
Rinterno N019 N020 51
XX10 N020 0 0 N021 coaxialCable
XX11 N021 N022 osc
R53 0 N021 51
R54 0 N022 51
XX12 N022 0 0 N023 coaxialCable
R55 N023 Vout 51
G§VCCS AmostragemI- N024 Vin 0 G
RL N024 AmostragemI+ R
* LPC-Link2
* LPC4370
* LPC-Link2
* LPC4370
* Iout
.lib .\OPA861Model.sub
.lib .\ad8130.cir
.backanno
.end